# EAGLE schematic usb_switcher_v1 (EAGLE 7.5.0)
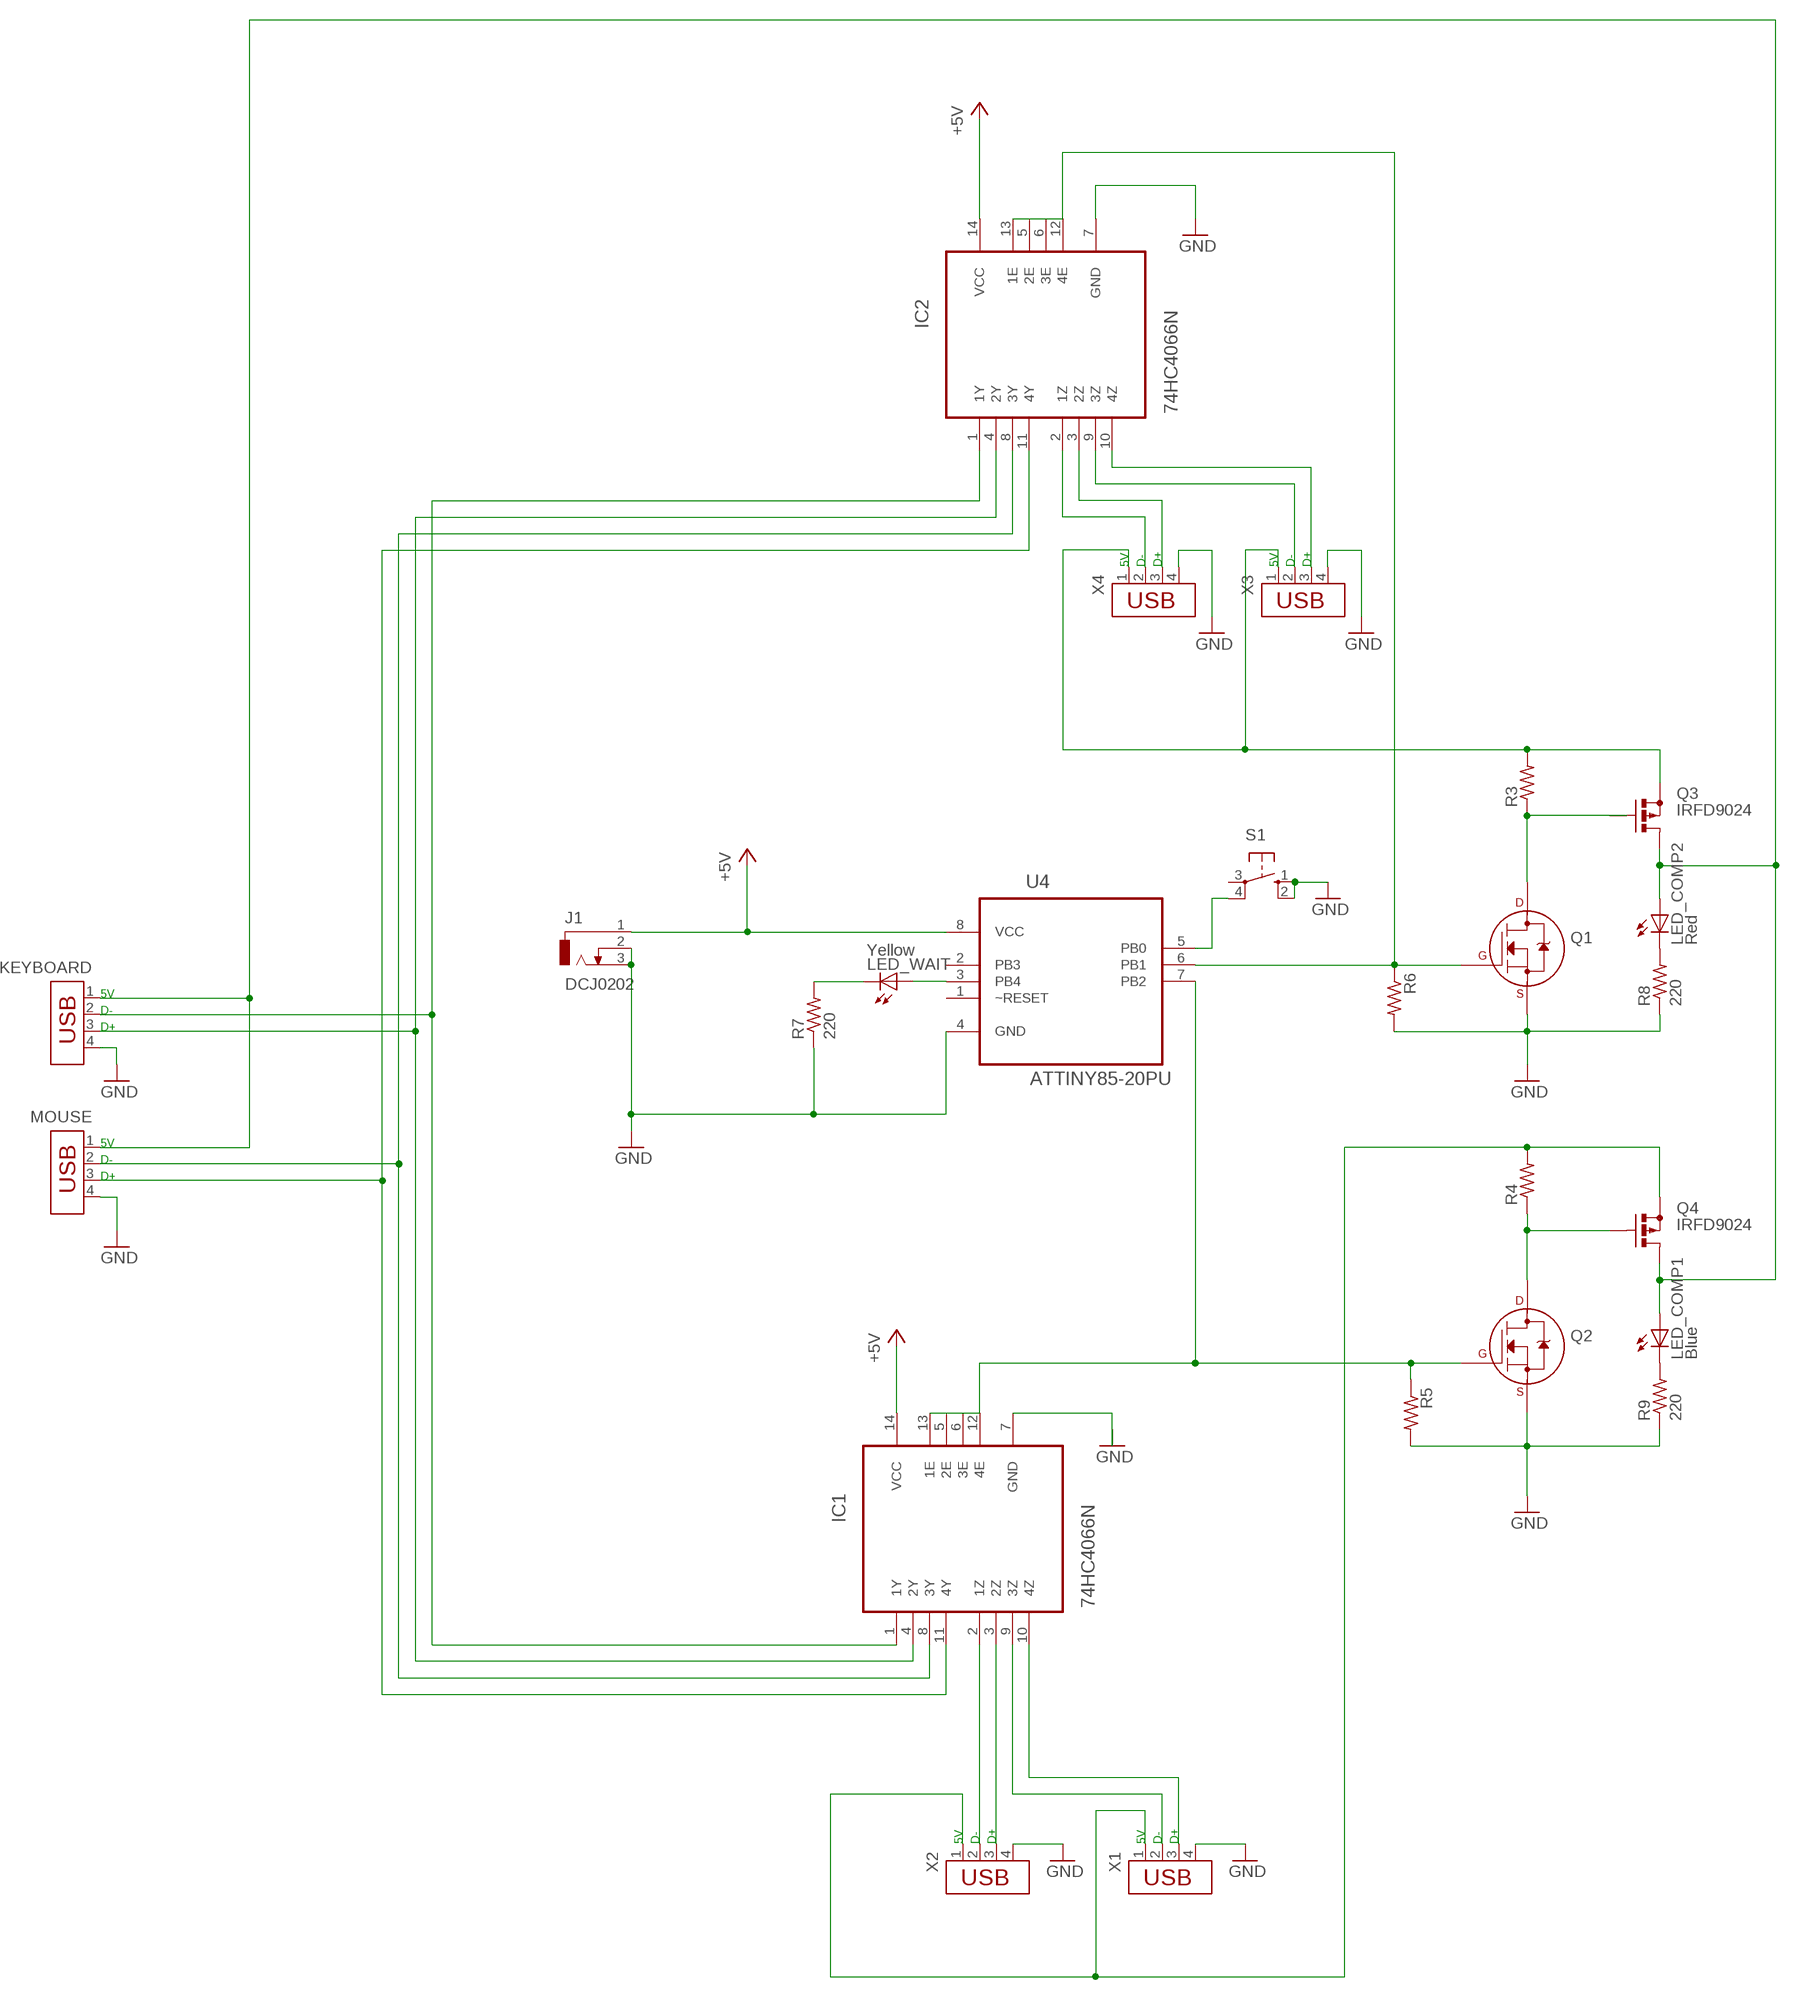
[diagram p0: schematic, sheet 1]

## Parts
IC1  74HC4066N  [DIP254P762X420-14]
IC2  74HC4066N  [DIP254P762X420-14]
J1  DCJ0202  [DCJ0202]
KEYBOARD  USB-787616  [USB]
LED_COMP1  Blue  LED5MM  [LED5MM]
LED_COMP2  Red  LED5MM  [LED5MM]
LED_WAIT  Yellow  LED5MM  [LED5MM]
MOUSE  USB-787616  [USB]
Q1  2N7000_TO92  [TO-92]
Q2  2N7000_TO92  [TO-92]
Q3  IRFD9024  IRFD9120  [C370-01]
Q4  IRFD9024  IRFD9120  [C370-01]
R3  R-US_0207/10  [0207/10]
R4  R-US_0207/10  [0207/10]
R5  R-US_0207/10  [0207/10]
R6  R-US_0207/10  [0207/10]
R7  220  R-US_0207/10  [0207/10]
R8  220  R-US_0207/10  [0207/10]
R9  220  R-US_0207/10  [0207/10]
S1  10-XX  [B3F-10XX]
U4  ATTINY85-20PU  [DIP254P762X533-8]
X1  USB-787616  [USB]
X2  USB-787616  [USB]
X3  USB-787616  [USB]
X4  USB-787616  [USB]

## Nets
5V: KEYBOARD.1 LED_COMP1.A LED_COMP2.A MOUSE.1 Q3.D Q3.D1(D) Q4.D Q4.D1(D)
+5V: IC1.14(VCC)
+5V_EXTERNAL: IC2.14(VCC) J1.1 U4.8(VCC) ; supply symbol labelled +5V
D+: IC1.4(2Y) IC2.4(2Y) KEYBOARD.3
D-: IC1.1(1Y) IC1.8(3Y) IC1.11(4Y) IC2.1(1Y) IC2.8(3Y) IC2.11(4Y) KEYBOARD.2 MOUSE.2 MOUSE.3
GND: IC2.7(GND) J1.2 J1.3 KEYBOARD.4 MOUSE.4 Q1.1(S) Q2.1(S) R5.2 R6.2 R7.1 R8.1 R9.1 S1.1(S) S1.2(S1) U4.4(GND) X1.4 X2.4 X3.4 X4.4
N$1: Q1.3(D) R3.1
N$2: IC2.5(2E) IC2.6(3E) IC2.12(4E) IC2.13(1E) Q1.2(G) R6.1 U4.6(PB1)
N$3: Q4.S R4.2 X1.1 X2.1
N$4: IC1.7(GND)
N$5: IC1.10(4Z) X1.3
N$6: IC1.2(1Z) X2.2
N$7: IC1.3(2Z) X2.3
N$8: LED_WAIT.K(C) R7.2
N$9: Q2.3(D) Q4.G R4.1
N$12: IC1.9(3Z) X1.2
N$13: LED_WAIT.A U4.3(PB4)
N$14: S1.4(P1) U4.5(PB0)
N$15: LED_COMP2.K(C) R8.2
N$16: LED_COMP1.K(C) R9.2
N$17: IC1.5(2E) IC1.6(3E) IC1.12(4E) IC1.13(1E) Q2.2(G) R5.1 U4.7(PB2)
N$19: IC2.2(1Z) X4.2
N$20: IC2.3(2Z) X4.3
N$21: IC2.9(3Z) X3.2
N$22: IC2.10(4Z) X3.3
N$23: Q3.S R3.2 X3.1 X4.1
Unconnected: Q3.G S1.3(P) U4.1(~RESET) U4.2(PB3)

## Notes on the sheet
- 5V | D- | D+ | 5V | D- | D+
- 5V
- D-
- D+
- 5V
- D-
- D+
- 5V | D- | D+ | 5V | D- | D+

## Library data of the parts
IC1 IC2 = NXP_By_element14_Batch_1:74HC4066N: Quad bilateral switches; MPN: 74HC4066N; OC_FARNELL: 380957; OC_NEWARK: 07WX3745; PACKAGE: DIP-14; SUPPLIER: NXP
J1 = con-jack:DCJ0202: DC POWER JACK Source: DCJ0202.pdf; OC_FARNELL: unknown; OC_NEWARK: unknown
KEYBOARD MOUSE X1-X4 = con-amp:USB-787616: AMP connector
LED_COMP1 LED_COMP2 LED_WAIT = led:LED: LED OSRAM: - CHIPLED LG R971, LG N971, LY N971, LG Q971, LY Q971, LO R971, LY R971 LH N974, LH R974 LS Q976, LO Q976, LY Q976 LO Q996 - Hyper CHIPLED LW Q18S LB Q993, LB Q99A, LB R99A - SideLED LS A670, LO A670, LY A670, LG A670, LP A670 LB A673, LV A673, LT A673, LW A673 LH A674 LY A675 LS A676, LA A676, LO A676, LY A676, LW A676 LS A679, LY A679, LG A679 - Hyper Micro SIDELED® LS Y876, LA Y876, LO Y876, LY Y876 LT Y87S - SmartLED LW L88C, LW L88S LB L89C, LB L89S, LG L890 LS L89K, LO L89K, LY L89K LS L896, LA L896, LO L896, LY L896 - TOPLED LS T670, LO T670, LY T670, LG T670, LP T670 LSG T670, LSP T670, LSY T670, LOP T670, LYG T670 LG T671, LOG T671, LSG T671 LB T673, LV T673, LT T673, LW T673 LH T674 LS T676, LA T676, LO T676, LY T676, LB T676, LH T676, LSB T676, LW T676 LB T67C, LV T67C, LT T67C, LS T67K, LO T67K, LY T67K, LW E67C LS E67B, LA E67B, LO E67B, LY E67B, LB E67C, LV E67C, LT E67C LW T67C LS T679, LY T679, LG T679 LS T770, LO T770, LY T770, LG T770, LP T770 LB T773, LV T773, LT T773, LW T773 LH T774 LS E675, LA E675, LY E675, LS T675 LS T776, LA T776, LO T776, LY T776, LB T776 LHGB T686 LT T68C, LB T68C - Hyper Mini TOPLED® LB M676 - Mini TOPLED Santana® LG M470 LS M47K, LO M47K, LY M47K Source: http://www.osram.convergy.de LUXEON: - LUMILED® LXK2-PW12-R00, LXK2-PW12-S00, LXK2-PW14-U00, LXK2-PW14-V00 LXK2-PM12-R00, LXK2-PM12-S00, LXK2-PM14-U00 LXK2-PE12-Q00, LXK2-PE12-R00, LXK2-PE12-S00, LXK2-PE14-T00, LXK2-PE14-U00 LXK2-PB12-K00, LXK2-PB12-L00, LXK2-PB12-M00, LXK2-PB14-N00, LXK2-PB14-P00, LXK2-PB14-Q00 LXK2-PR12-L00, LXK2-PR12-M00, LXK2-PR14-Q00, LXK2-PR14-R00 LXK2-PD12-Q00, LXK2-PD12-R00, LXK2-PD12-S00 LXK2-PH12-R00, LXK2-PH12-S00 LXK2-PL12-P00, LXK2-PL12-Q00, LXK2-PL12-R00 Source: www.luxeon.com KINGBRIGHT: KA-3528ASYC Source: www.kingbright.com
Q1 Q2 = transistors:2N700*: 2N7000, 2N7002, NDS7002A N-channel enhancement mode MOSFET
Q3 Q4 = transistor-small-signal:IRFD9120: P-CHANNEL MOS FET
R3-R9 = resistor:R-US_: RESISTOR, American symbol
S1 = switch-omron:10-XX: OMRON SWITCH; MPN: B3F-1000; OC_FARNELL: 176432; OC_NEWARK: 36M3542
U4 = joe_atlib:ATTINY85-20PU: 8-bit Microcontroller with In-System Programmable Flash; MPN: ATTINY85-20PU; OC_FARNELL: 1455162; OC_NEWARK: 58M3796; PACKAGE: PDIP-8; SUPPLIER: Atmel